# Altium schematic sheet Voeding.SchDoc
size A4; SheetNumber: 4; SheetTotal: 4
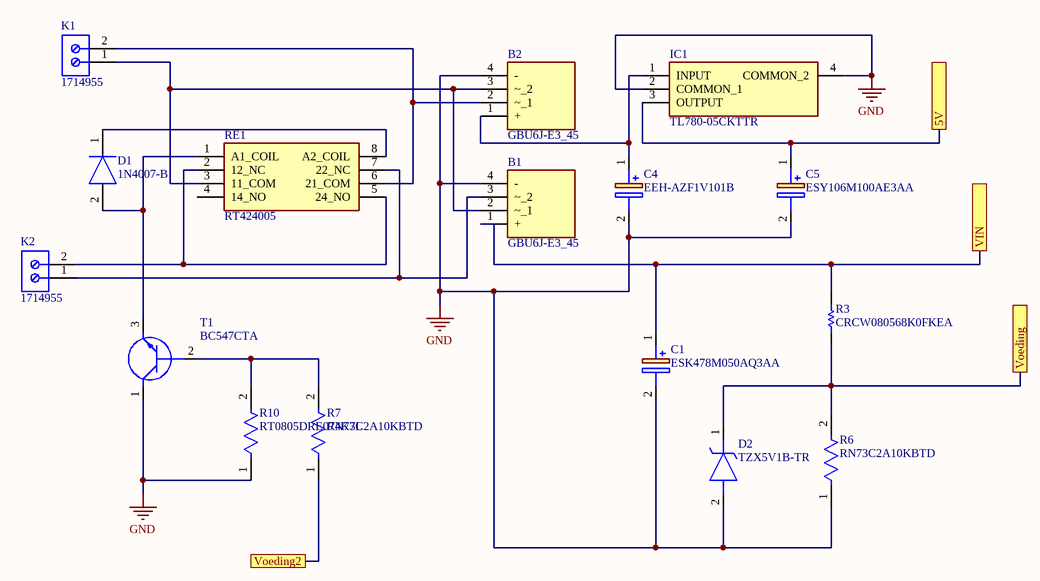
[diagram p0: Voeding.SchDoc]

## Parts
B1  GBU6J-E3_45  [GBU6JE345]
B2  GBU6J-E3_45  [GBU6JE345]
C1  ESK478M050AQ3AA  [CAPPRD1000W80D2200H3700]
C4  EEH-AZF1V101B  [CAPPRD350W65D800H1050]
C5  ESY106M100AE3AA  [CAPPRD250W50D630H1250]
D1  1N4007-B  [DIOAD1410W90L470D235]
D2  TZX5V1B-TR  [DIOAD950W60L350D150]
IC1  TL780-05CKTTR  [TL78005CKTTR]
K1  1714955  [PHOE-1714955_V]
K2  1714955  [PHOE-1714955_V]
R3  CRCW080568K0FKEA  [RESC2013X50X30ML20T20]
R6  RN73C2A10KBTD  [FP-RN732A-MFG]
R7  RN73C2A10KBTD  [FP-RN732A-MFG]
R10  RT0805DRE074K7L  [FP-RT0805-MFG]
RE1  RT424005  [RT42]
T1  BC547CTA  [MC79L15ACPG]

## Ports
5V, VIN, Voeding, Voeding2

## Nets
GND: B1.4(-) B2.4(-) C1.2(-) C4.2(-) C5.2(-) D2.2(A) IC1.2(COMMON_1) IC1.4(COMMON_2) R6.1 R10.1 T1.1(C)
5V: C5.1(+) IC1.3(OUTPUT) ; port 5V
VIN: B1.1(+) C1.1(+) R3.2 ; port VIN
Voeding: D2.1(K) R3.1 R6.2 ; port Voeding
Voeding2: R7.1 ; port Voeding2
NetB1_2: B1.2(~_1) B2.3(~_2) K1.1 RE1.3(11_COM)
NetB1_3: B1.3(~_2) K2.1 RE1.7(22_NC)
NetB2_1: B2.1(+) C4.1(+) IC1.1(INPUT)
NetB2_2: B2.2(~_1) K1.2 RE1.6(21_COM)
NetD1_1: D1.1(K) RE1.8(A2_COIL)
NetD1_2: D1.2(A) RE1.1(A1_COIL) T1.3(E)
NetK2_2: K2.2 RE1.2(12_NC) RE1.5(24_NO)
NetR7_2: R7.2 R10.2 T1.2(B)

Not connected (* = marked no-connect by the designer): RE1 4(14_NO)

## Library data of the parts
B1 B2 = GBU6J-E3_45: Bridge Rectifier; Manufacturer_Name: Vishay; Manufacturer_Part_Number: GBU6J-E3/45; Datasheet Link: http://www.vishay.com/docs/88615/gbu6a.pdf; Height: 18.8mm
C1 = ESK478M050AQ3AA: Capacitor Polarised; Manufacturer_Name: Kemet; Datasheet Link: https://componentsearchengine.com//ESK478M050AQ3AA.pdf; Height: 37mm; Mouser2 Part Number: 80-ESK478M050AQ3AA; Mouser2 Price/Stock: https://www.mouser.com/Search/Refine.aspx?Keyword=80-ESK478M050AQ3AA; Manufacturer_Part_Number: ESK478M050AQ3AA
C4 = EEH-AZF1V101B: Capacitor Polarised; Manufacturer_Name: Panasonic; Datasheet Link: http://industrial.panasonic.com/cdbs/www-data/pdf/RDD0000/RDD0000C1240.pdf; Height: 10.5mm; Manufacturer_Part_Number: EEH-AZF1V101B
C5 = ESY106M100AE3AA: Capacitor Polarised; Manufacturer_Name: Kemet; Datasheet Link: https://connect.kemet.com:7667/gateway/IntelliData-ComponentDocumentation/1.0/download/specsheet/ESY106M100AE3AA; Height: 12.5mm; Manufacturer_Part_Number: ESY106M100AE3AA
D1 = 1N4007-B: Diode; Manufacturer_Name: Rectron; Datasheet Link: https://www.arrow.com/en/products/1n4007-b/rectron; Manufacturer_Part_Number: 1N4007-B
D2 = TZX5V1B-TR: Zener Diode; Manufacturer_Name: Vishay; Datasheet Link: https://componentsearchengine.com/Datasheets/1/TZX5V1B-TR.pdf; Manufacturer_Part_Number: TZX5V1B-TR
IC1 = TL780-05CKTTR: Integrated Circuit; Manufacturer_Name: Texas Instruments; Datasheet Link: http://www.ti.com/general/docs/suppproductinfo.tsp?distId=26&gotoUrl=http%3A%2F%2Fwww.ti.com%2Flit%2Fgpn%2Ftl780; Height: 5.08mm; Manufacturer_Part_Number: TL780-05CKTTR
K1 K2 = CMP-2000-05797-1: PC Terminal Block, Pitch 6.35 mm, 1 x 2 Position, Height 21.5 mm, Tail Lenght 5.1 mm, RoHS, Bulk; Manufacturer: Phoenix Contact; Package Description: PC Terminal Block, Pitch 6.35 mm, 1 x 2 Position, Height 21.5 mm, Tail Lenght 5.1 mm; Datasheet URL: http://media.digikey.com/pdf/Data%20Sheets/Phoenix%20Contact%20PDFs/1714955.pdf; Package Reference: 1714955; Manufacturer URL: http://www.phoenixcontact.com/; Datasheet Version: 02/2010; Mounting Technology: ThroughHole
R3 = CMP-2001-04072-1: Manufacturer: Vishay Dale; Part Number: CRCW080568K0FKEA
R6 R7 = CMP-03211-006013-1: SMD Chip Resistor, Thin Film, 10KΩ, 100 V, 0805 [2012 Metric], 100 mW, 0.1%, RN73 Series; Manufacturer: TE Connectivity; Voltage Rating: 100V; Power Rating: 0.1W; Temperature Coefficient: 10ppm/°C; Value: 10KΩ; Lead Free: Yes; Temperature Range Low: -55°C; Temperature: -55°C to 155°C; RoHS: TRUE; Category: Res; Device Class L3: Chip SMD Resistors; Device Class L1: Passive Components; Resistance: 10KΩ; ComponentLink2URL: https://www.te.com/commerce/DocumentDelivery/DDEController?Action=showdoc&DocId=Data+Sheet%7F1773270%7FP%7Fpdf%7FEnglish%7FENG_DS_1773270_P.pdf%7F1676162-2; Device Class L2: Resistors; Ipc Land Pattern Name: RESC200125X55; Automotive: No; Temperature Range High: 155°C; Height: 0.65mm; octopart_url: https://octopart.com/rn73c2a10kbtd-te+connectivity-22737006; Package: RN732A; Composition: Thin Film; packaging: 5000 Reel; Series: RN73; Manufacturer Part Number: RN73C2A10KBTD; ComponentLink2Description: Datasheet; Octopart: https://octopart.com/rn73c2a10kbtd-te+connectivity-22737006; Tolerance: 0.1%
R10 = CMP-03412-005354-1: RES SMD 4.7K OHM 0.5% 1/8W 0805; Manufacturer: Yageo; Value: 4.7KΩ; Power Rating: 0.125W; Tolerance: 0.01; Voltage Rating: 150V; Temperature Coefficient: 50 ppm/°C; Lead Free: Yes; Device Class L2: Resistors; ComponentLink2Description: Datasheet; RoHS: TRUE; Package: RT0805; Resistance: 4.7KΩ; Device Class L3: Chip SMD Resistors; Ipc Land Pattern Name: RESC200125X50; Category: Res; Octopart: https://octopart.com/rt0805dre074k7l-yageo-1242027; Temperature: -55°C to +155°C; Temperature Range High: +155°C; Digikey Description: RES SMD 4.7K OHM 0.5% 1/8W 0805; Series: RT; Height: 0.6mm; Footprint Url: http://www.yageo.com/exep/pages/download/literatures/PYu-R_Mount_10.pdf; Device Class L1: Passive Components; Temperature Range Low: -55°C; Composition: Thin Film; Manufacturer Part Number: RT0805DRE074K7L; ComponentLink2URL: http://www.yageo.com/documents/recent/PYu-RT_1-to-0.01_RoHS_L_9.pdf; Automotive: No
RE1 = RT424005: Relay or Contactor; Manufacturer_Name: TE Connectivity; Datasheet Link: https://componentsearchengine.com//RT424005.pdf; Mouser2 Part Number: 655-RT424005; Mouser2 Price/Stock: https://www.mouser.com/Search/Refine.aspx?Keyword=655-RT424005; Manufacturer_Part_Number: RT424005
T1 = BC547CTA: Transistor BJT NPN; Manufacturer_Name: ON Semiconductor; Datasheet Link: http://www.onsemi.com/pub/Collateral/BC550-D.pdf; Manufacturer_Part_Number: BC547CTA